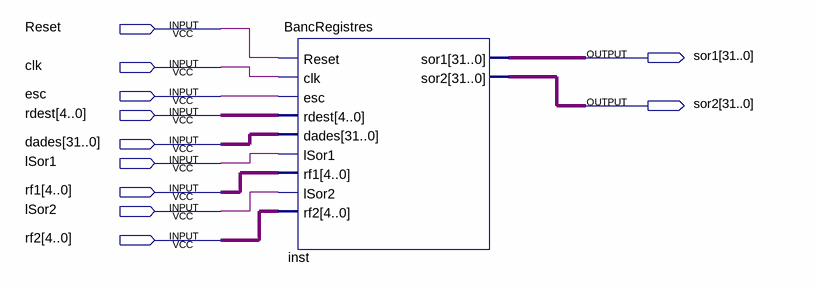
[diagram p0: schematic sheet]
// Quartus schematic Banc_Registres.bdf as structural Verilog: 1 symbols, 11 pins
module Banc_Registres (
  input  Reset,
  input  clk,
  input  esc,
  input  [4:0] rdest,
  input  [31:0] dades,
  input  lSor1,
  input  [4:0] rf1,
  input  lSor2,
  input  [4:0] rf2,
  output [31:0] sor1,
  output [31:0] sor2
);

  BancRegistres inst (
    .Reset(Reset), .clk(clk), .esc(esc), .rdest(rdest), .dades(dades), .lSor1(lSor1), .rf1(rf1),
    .lSor2(lSor2), .rf2(rf2), .sor1(sor1), .sor2(sor2));
endmodule
